# Altium schematic sheet Spacer_M2.5.SchDoc
size A4
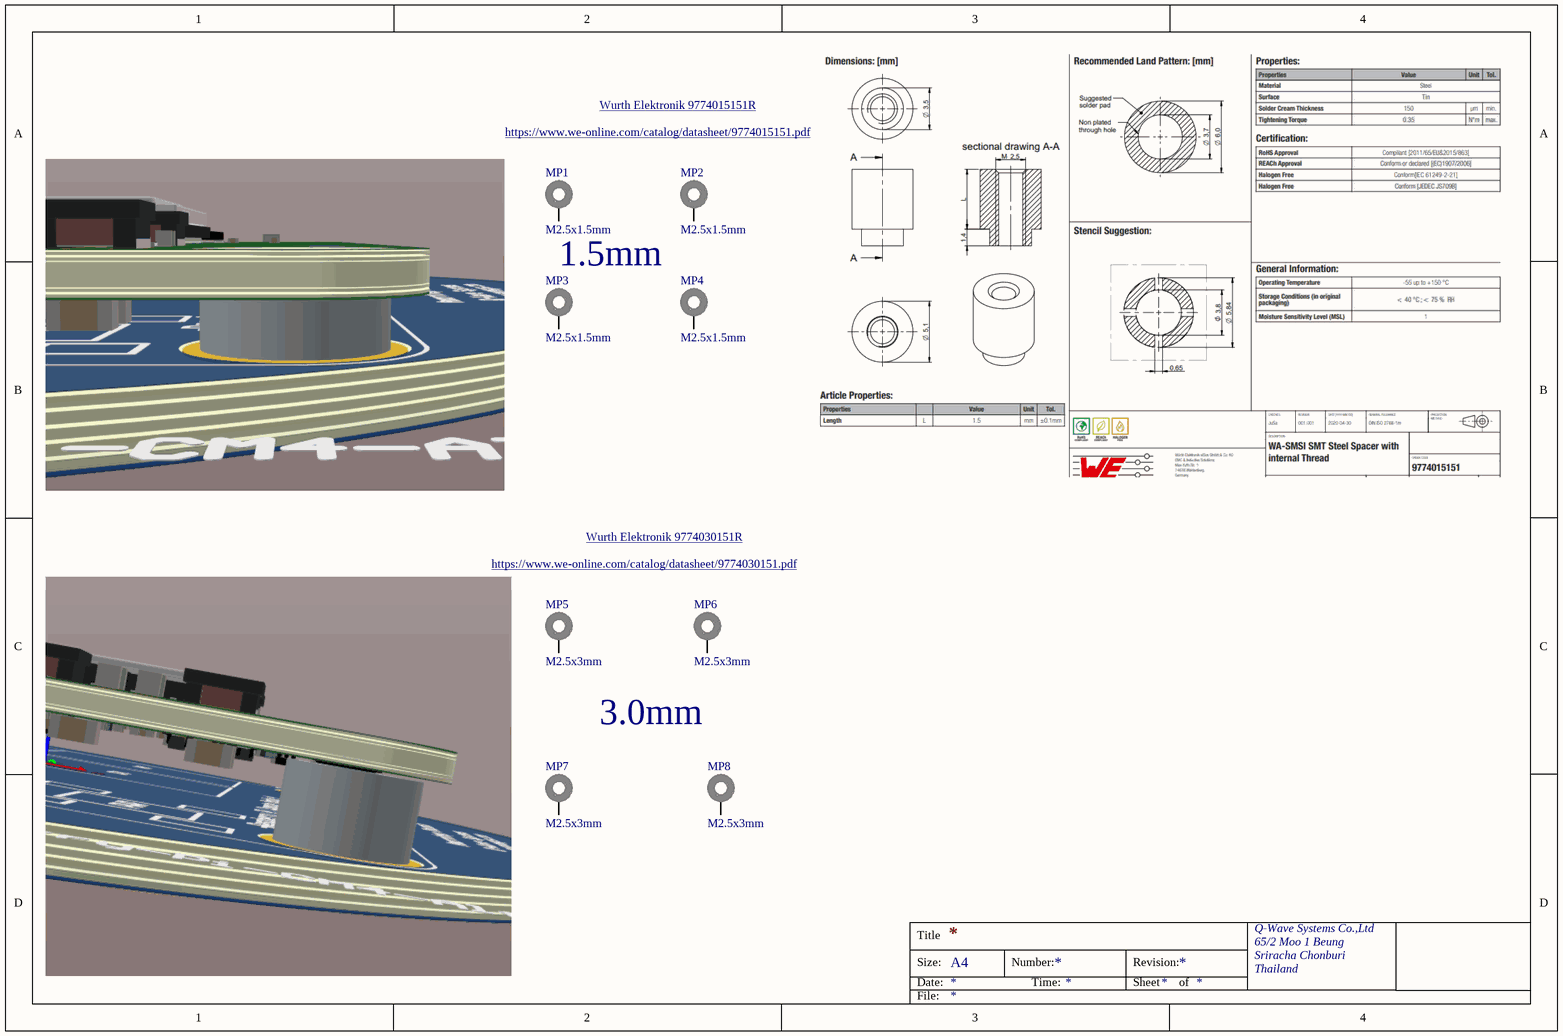
[diagram p0: Spacer_M2.5.SchDoc]

## Parts
MP1  M2.5x1.5mm  [9774015151]
MP2  M2.5x1.5mm  [9774015151]
MP3  M2.5x1.5mm  [9774015151]
MP4  M2.5x1.5mm  [9774015151]
MP5  M2.5x3mm  [9774030151]
MP6  M2.5x3mm  [9774030151]
MP7  M2.5x3mm  [9774030151]
MP8  M2.5x3mm  [9774030151]

## Nets

Not connected (* = marked no-connect by the designer): MP1 1; MP2 1; MP3 1; MP4 1; MP5 1; MP6 1; MP7 1; MP8 1

## Notes on the sheet
- Wurth Elektronik 9774015151R <https://th.mouser.com/ProductDetail/Wurth-Elektronik/9774015151R?qs=KRpiEsko4Hl%2FDg5uCSpysw%3D%3D>
- https://www.we-online.com/catalog/datasheet/9774015151.pdf
- 1.5mm
- https://www.we-online.com/catalog/datasheet/9774030151.pdf
- Wurth Elektronik 9774030151R <https://th.mouser.com/ProductDetail/Wurth-Elektronik/9774030151R?qs=%2Fha2pyFaduhpL3ruLypYIwk1EDfzek6QtU2BoXAdTMSAq8D2gXpyew%3D%3D>
- 3.0mm
- Title
- Size:
- Date:
- A4
- Number:
- Time:
- Revision:
- Sheet
- of
- Q-Wave Systems Co.,Ltd
- 65/2 Moo 1 Beung
- Sriracha Chonburi
- Thailand
- File:

## Library data of the parts
MP1-MP4 = 9774015151: WA-SMSI SMT Steel Spacer, M2.5 Thread Internal, OD 5.1mm, M2.5x1.5mm; Manufacturer: Wurth Elektronik; Inner Diameter: 3.5mm; Surface: Tin; ComponentLink1Description: Manufacturer; ComponentLink1URL: http://www.we-online.de; ComponentLink2Description: Datasheet; ComponentLink2URL: https://www.we-online.com/catalog/datasheet/9774015151.pdf; Mounting Technology: SMT; Packaging: Bulk; Manufacturer Part Number: 9774015151; Length: 1.5mm; Inner Thread Length: -; Operating Temperature: -55 to +150degC; Outer Diameter: 5.1mm; Published Date: April 2020; Material: Steel; Thread: M2.5
MP5-MP8 = 9774030151: WA-SMSI SMT Steel Spacer, M2.5 Thread Internal, OD 5.1mm, M2.5x3mm; Manufacturer: Wurth Elektronik; Inner Diameter: 3.5mm; Surface: Tin; ComponentLink1Description: Manufacturer; ComponentLink1URL: http://www.we-online.de; ComponentLink2Description: Datasheet; ComponentLink2URL: https://www.we-online.com/catalog/datasheet/9774030151.pdf; Mounting Technology: SMT; Packaging: Bulk; Manufacturer Part Number: 9774030151; Length: 3mm; Inner Thread Length: -; Operating Temperature: -55 to +150degC; Outer Diameter: 5.1mm; Published Date: April 2020; Material: Steel; Thread: M2.5